# EAGLE design 05_NOT (EAGLE 7.5.0)
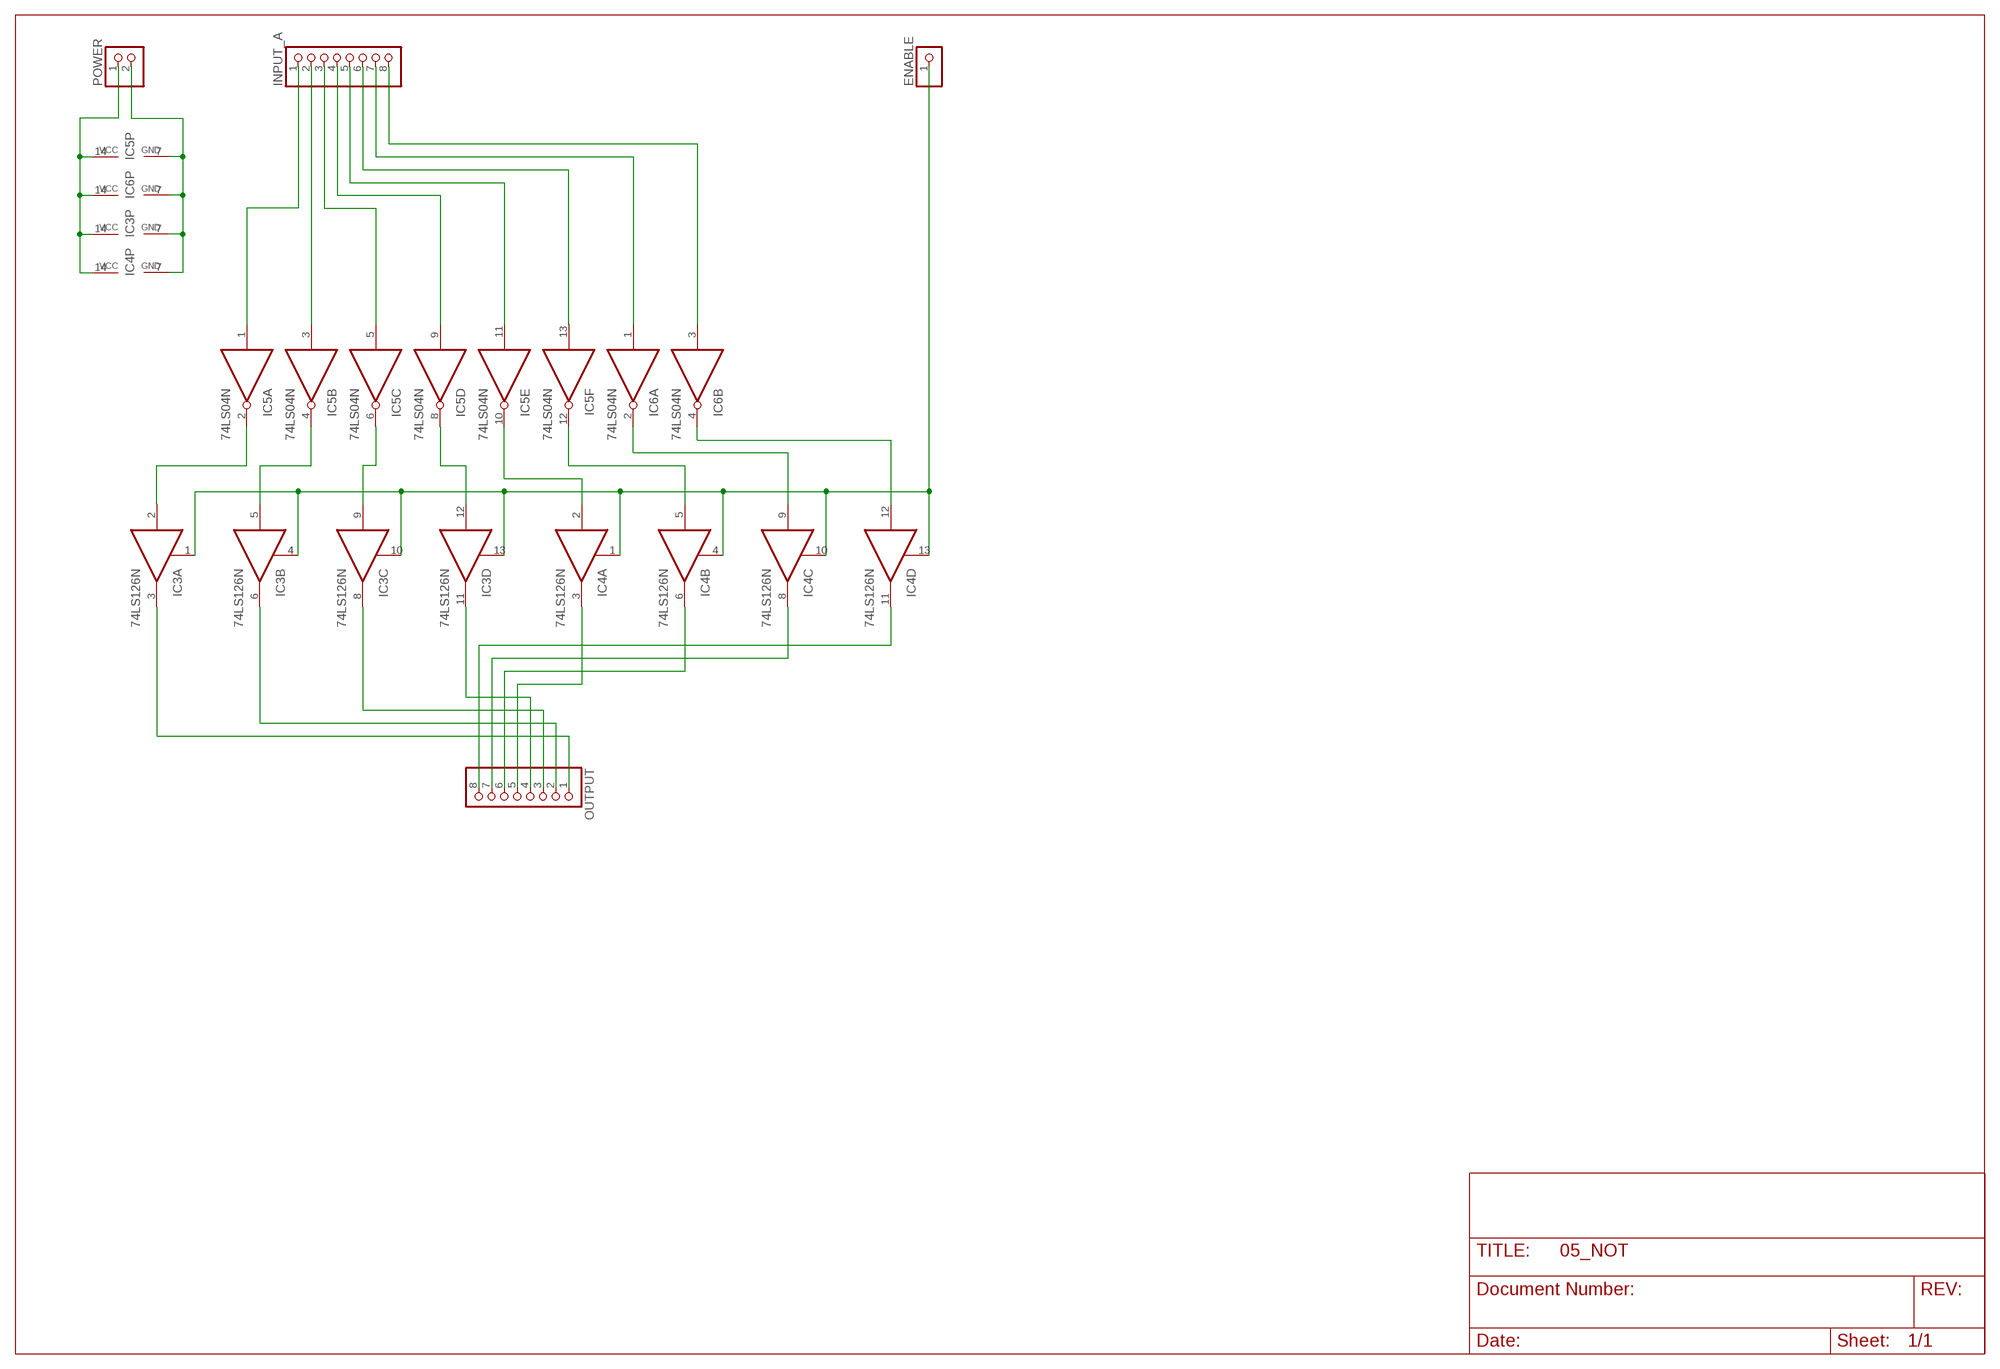
[diagram p0: schematic, sheet 1]

## Parts
ENABLE  PINHD-1X1  [1X01]
IC3  74LS126N  [DIL14]
IC4  74LS126N  [DIL14]
IC5  74LS04N  [DIL14]
IC6  74LS04N  [DIL14]
INPUT_A  PINHD-1X8  [1X08]
OUTPUT  PINHD-1X8  [1X08]
POWER  PINHD-1X2  [1X02]

## Nets
GND: IC3.7(P:GND) IC4.7(P:GND) IC5.7(P:GND) IC6.7(P:GND) POWER.2
N$1: IC5.1(A:I) INPUT_A.1
N$3: IC5.3(B:I) INPUT_A.2
N$5: IC5.5(C:I) INPUT_A.3
N$7: IC5.9(D:I) INPUT_A.4
N$9: IC5.11(E:I) INPUT_A.5
N$11: IC5.13(F:I) INPUT_A.6
N$13: IC6.1(A:I) INPUT_A.7
N$15: IC6.3(B:I) INPUT_A.8
N$18: IC3.5(B:I) IC5.4(B:O)
N$19: IC3.9(C:I) IC5.6(C:O)
N$20: IC3.12(D:I) IC5.8(D:O)
N$21: IC4.2(A:I) IC5.10(E:O)
N$22: IC4.5(B:I) IC5.12(F:O)
N$23: IC4.9(C:I) IC6.2(A:O)
N$24: IC4.12(D:I) IC6.4(B:O)
N$25: IC3.3(A:O) OUTPUT.1
N$26: IC3.6(B:O) OUTPUT.2
N$27: IC3.8(C:O) OUTPUT.3
N$28: IC3.11(D:O) OUTPUT.4
N$29: IC4.3(A:O) OUTPUT.5
N$30: IC4.6(B:O) OUTPUT.6
N$31: IC4.8(C:O) OUTPUT.7
N$32: IC4.11(D:O) OUTPUT.8
N$33: ENABLE.1 IC3.1(A:OE) IC3.4(B:OE) IC3.10(C:OE) IC3.13(D:OE) IC4.1(A:OE) IC4.4(B:OE) IC4.10(C:OE) IC4.13(D:OE)
N$34: IC3.2(A:I) IC5.2(A:O)
VCC: IC3.14(P:VCC) IC4.14(P:VCC) IC5.14(P:VCC) IC6.14(P:VCC) POWER.1
Unconnected: IC6.5(C:I) IC6.6(C:O) IC6.8(D:O) IC6.9(D:I) IC6.10(E:O) IC6.11(E:I) IC6.12(F:O) IC6.13(F:I)

## Library data of the parts
ENABLE = pinhead:PINHD-1X1: PIN HEADER
IC3 IC4 = 74xx-eu:74*126: Quad bus BUFFER, 3-state
IC5 IC6 = 74xx-eu:74*04: Hex INVERTER
INPUT_A OUTPUT = pinhead:PINHD-1X8: PIN HEADER
POWER = pinhead:PINHD-1X2: PIN HEADER

## Board
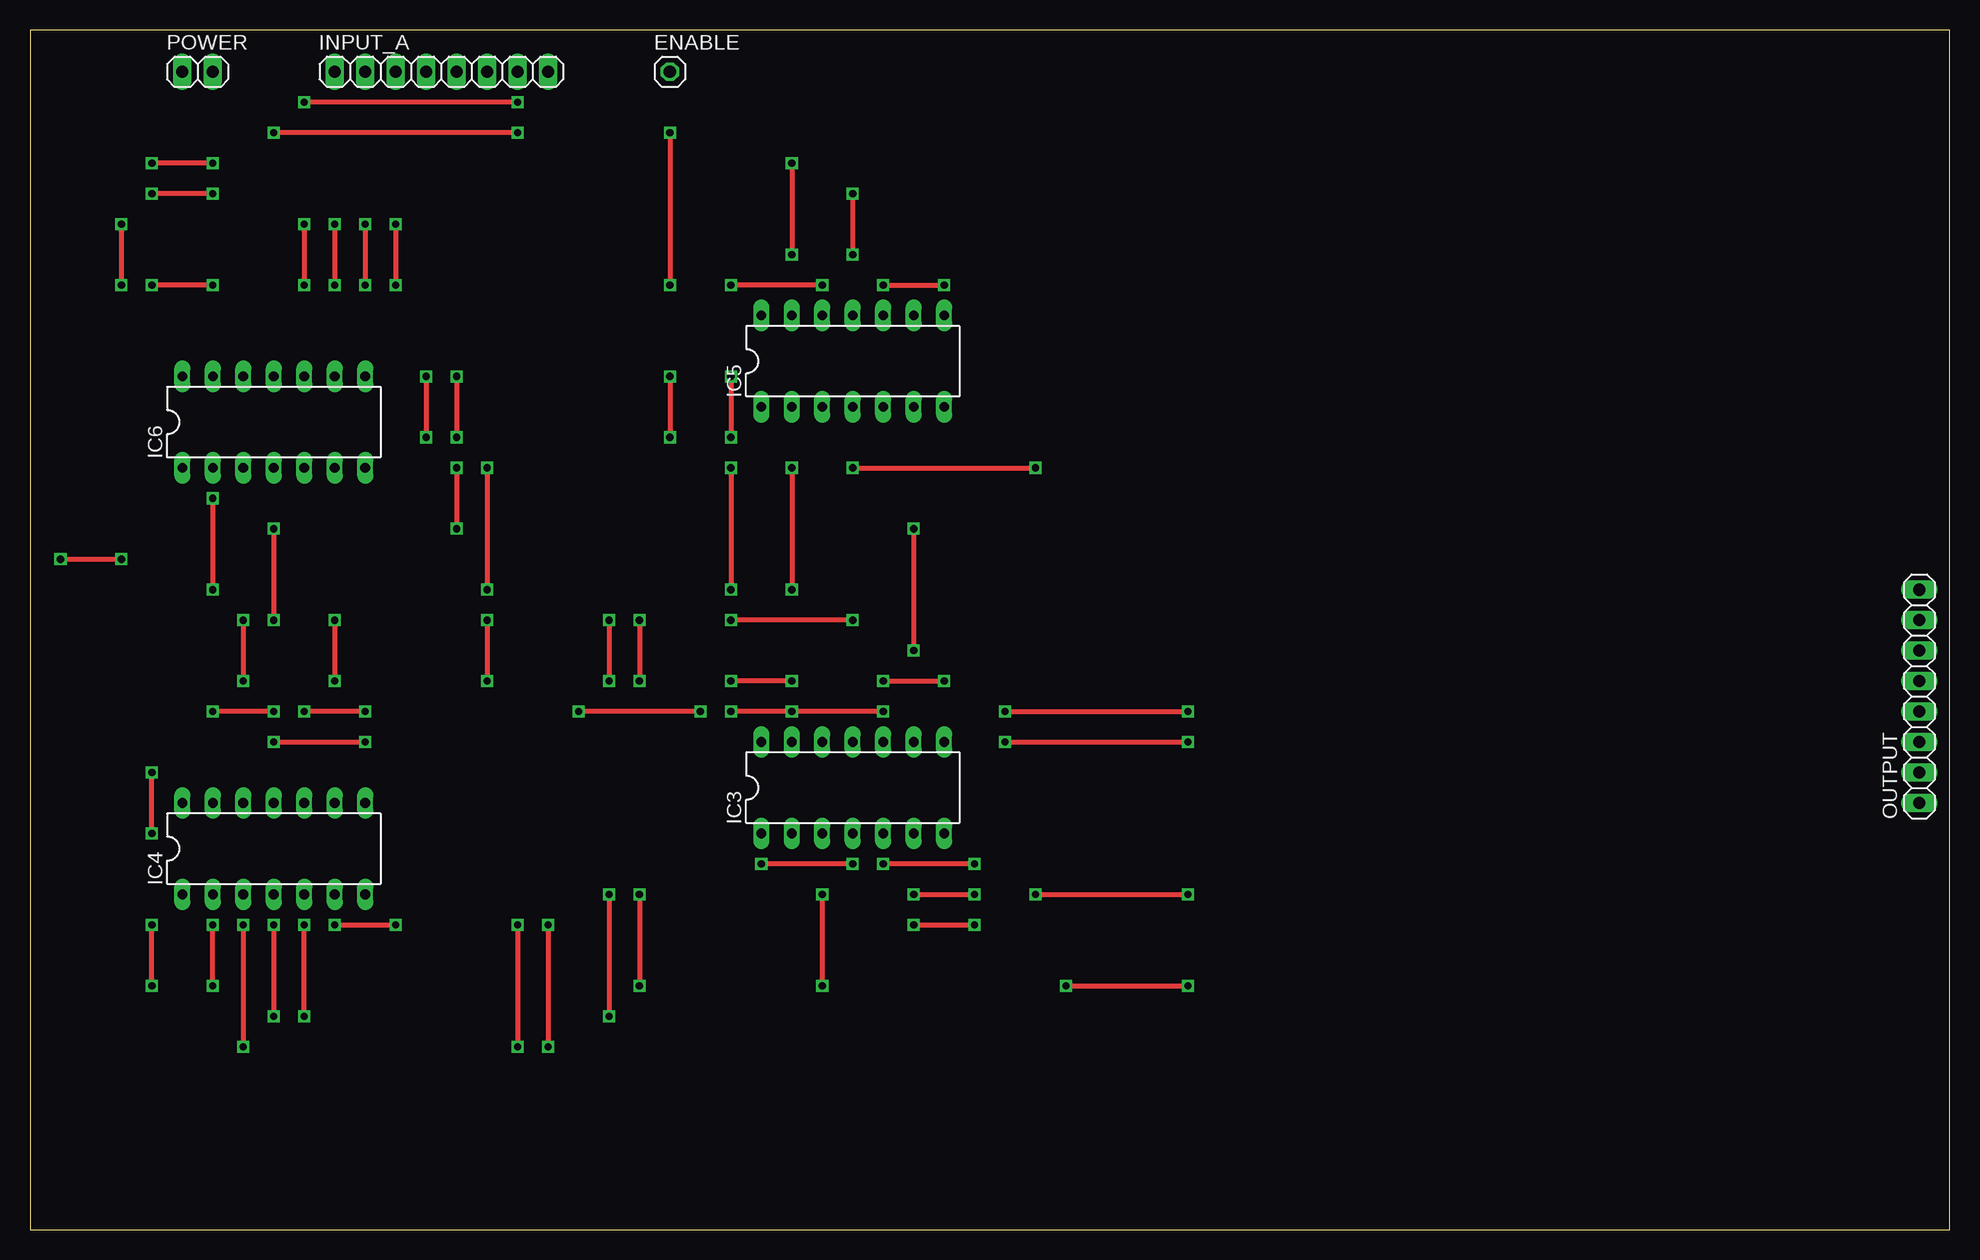
[diagram p1: board, top side]
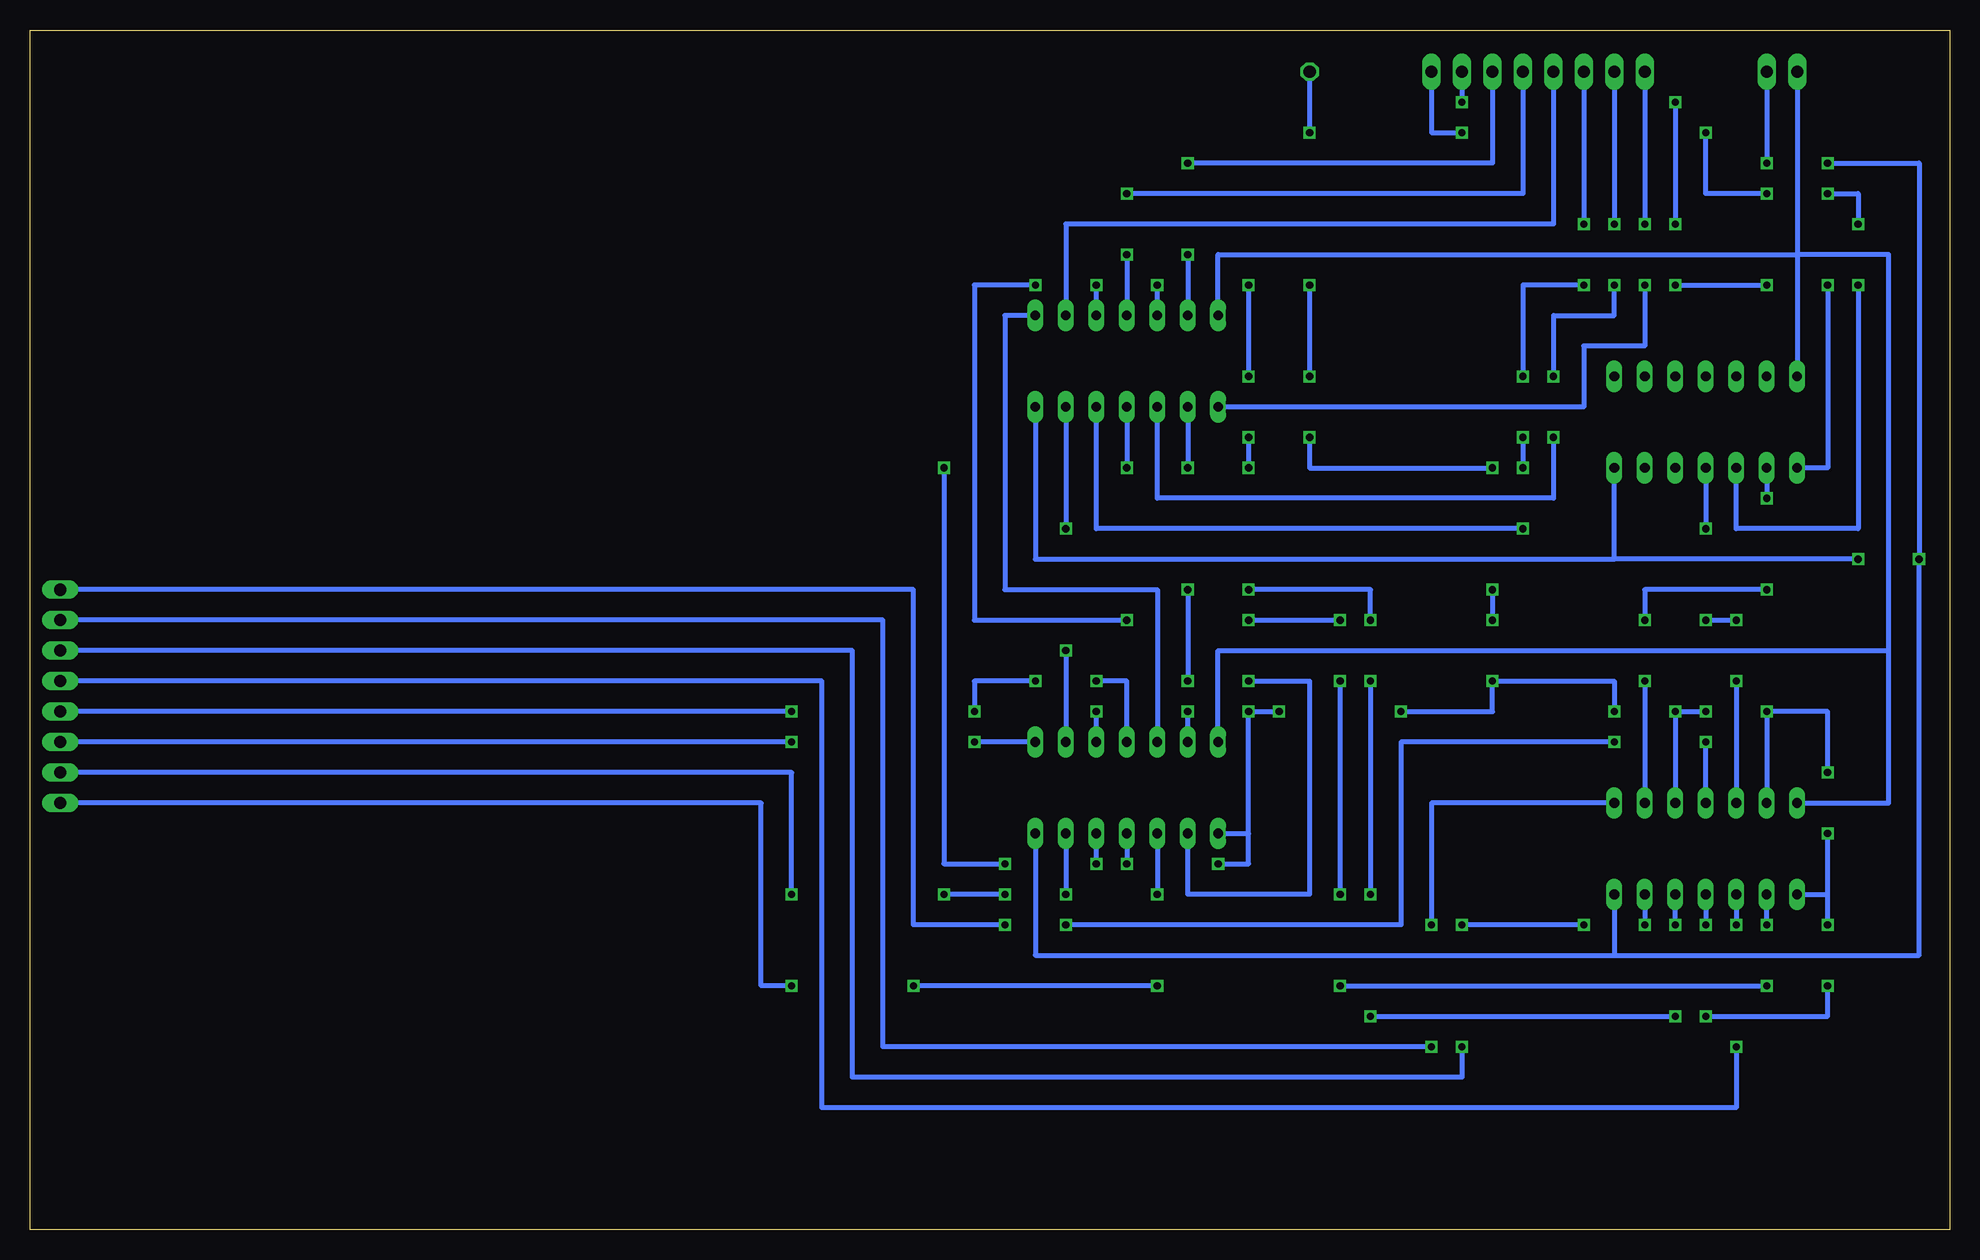
[diagram p2: board, bottom side, seen from below]

Size 160 x 100 mm. Coordinates in mm from the lower left corner, seen from the top.
Outline: 0,0 160,0 160,100 0,100 0,0
Copper layers (1*16): Top 0.035mm / dielectric 1.5mm / Bottom 0.035mm
Design rules "default": minimum track width 10mil, minimum drill 24mil, track to track 8mil, track to pad 8mil, pad to pad 8mil, via to via 8mil, smd to smd 8mil, copper to edge 40mil, drill to drill 8mil, minimum pad ring 10mil, minimum via ring 8mil, stop-mask expansion 4mil, vias tented up to drill 0mil, thermal gap 10mil

### Footprints (pad centres in the part's own frame; a part is rotated, then mirrored left to right if it is on the bottom)
1X01 = drill 1.016 octagon: 1 0,0
DIL14 = drill 0.813 long: 1 -7.62,-3.81; 2 -5.08,-3.81; 3 -2.54,-3.81; 4 0,-3.81; 5 2.54,-3.81; 6 5.08,-3.81; 7 7.62,-3.81; 8 7.62,3.81; 9 5.08,3.81; 10 2.54,3.81; 11 0,3.81; 12 -2.54,3.81; 13 -5.08,3.81; 14 -7.62,3.81
1X08 = drill 1.016 long: 1 -8.89,0; 2 -6.35,0; 3 -3.81,0; 4 -1.27,0; 5 1.27,0; 6 3.81,0; 7 6.35,0; 8 8.89,0
1X02 = drill 1.016 long: 1 -1.27,0; 2 1.27,0

### Placement (x,y rotation side)
ENABLE  53.34,96.52 0 top
IC3  68.58,36.83 0 top
IC4  20.32,31.75 0 top
IC5  68.58,72.39 0 top
IC6  20.32,67.31 0 top
INPUT_A  34.29,96.52 0 top
OUTPUT  157.48,44.45 90 top
POWER  13.97,96.52 0 top

### Tracks (layer width: path | path; a pad name or v marks a point on that pad's centre or on a via)
GND  (via drill 0.6)
  Top 0.406: v15.24,88.9 v10.16,88.9 | v2.54,55.88 v7.62,55.88
  Bottom 0.406: POWER.2 v15.24,88.9 | v10.16,88.9 2.54,88.9 v2.54,55.88 2.54,22.86 27.94,22.86 | v7.62,55.88 27.94,55.88 | 27.94,55.88 IC6.7 | IC5.7 76.2,55.88 27.94,55.88 | IC4.7 27.94,22.86 | IC3.7 76.2,22.86 27.94,22.86
N$1  (via drill 0.6)
  Top 0.406: v25.4,83.82 v25.4,78.74
  Bottom 0.406: INPUT_A.1 v25.4,83.82 | v25.4,78.74 25.4,73.66 30.48,73.66 30.48,68.58 IC5.1
N$3  (via drill 0.6)
  Top 0.406: v27.94,83.82 v27.94,78.74 | v33.02,71.12 v33.02,66.04
  Bottom 0.406: INPUT_A.2 v27.94,83.82 | v33.02,71.12 33.02,76.2 27.94,76.2 v27.94,78.74 | v33.02,66.04 33.02,60.96 66.04,60.96 IC5.3
N$5  (via drill 0.6)
  Top 0.406: v30.48,83.82 v30.48,78.74 | v35.56,71.12 v35.56,66.04 | v35.56,63.5 v35.56,58.42
  Bottom 0.406: INPUT_A.3 v30.48,83.82 | v30.48,78.74 35.56,78.74 v35.56,71.12 | v35.56,66.04 v35.56,63.5 | v35.56,58.42 71.12,58.42 IC5.5
N$7
  Bottom 0.406: INPUT_A.4 33.02,83.82 73.66,83.82 IC5.9
N$9  (via drill 0.6)
  Top 0.406: v68.58,86.36 v68.58,81.28
  Bottom 0.406: INPUT_A.5 35.56,86.36 v68.58,86.36 | v68.58,81.28 IC5.11
N$11  (via drill 0.6)
  Top 0.406: v63.5,88.9 v63.5,81.28
  Bottom 0.406: INPUT_A.6 38.1,88.9 v63.5,88.9 | v63.5,81.28 IC5.13
N$13  (via drill 0.6)
  Top 0.406: v40.64,93.98 v22.86,93.98 | v22.86,83.82 v22.86,78.74 | v15.24,78.74 v10.16,78.74
  Bottom 0.406: INPUT_A.7 v40.64,93.98 | v22.86,93.98 v22.86,83.82 | v22.86,78.74 v15.24,78.74 | v10.16,78.74 10.16,63.5 IC6.1
N$15  (via drill 0.6)
  Top 0.406: v40.64,91.44 v20.32,91.44 | v15.24,86.36 v10.16,86.36 | v7.62,83.82 v7.62,78.74
  Bottom 0.406: INPUT_A.8 43.18,91.44 v40.64,91.44 | v10.16,86.36 7.62,86.36 v7.62,83.82 | v7.62,78.74 7.62,58.42 17.78,58.42 IC6.3 | v15.24,86.36 20.32,86.36 v20.32,91.44
N$18  (via drill 0.6)
  Top 0.406: v68.58,63.5 v83.82,63.5 | v78.74,30.48 v71.12,30.48
  Bottom 0.406: IC5.4 v68.58,63.5 | v83.82,63.5 83.82,30.48 v78.74,30.48 | v71.12,30.48 IC3.5
N$19  (via drill 0.6)
  Top 0.406: v73.66,58.42 v73.66,48.26
  Bottom 0.406: IC5.6 v73.66,58.42 | v73.66,48.26 IC3.9
N$20
  Bottom 0.406: IC5.8 78.74,76.2 78.74,53.34 66.04,53.34 IC3.12
N$21  (via drill 0.6)
  Top 0.406: v71.12,78.74 v76.2,78.74 | v68.58,50.8 v58.42,50.8 | v50.8,27.94 v50.8,20.32 | v15.24,20.32 v15.24,25.4 | v50.8,50.8 v50.8,45.72
  Bottom 0.406: IC5.10 v71.12,78.74 | v76.2,78.74 81.28,78.74 81.28,50.8 v68.58,50.8 | v58.42,50.8 v50.8,50.8 | v50.8,20.32 v15.24,20.32 | v15.24,25.4 IC4.2 | v50.8,45.72 v50.8,27.94
N$22  (via drill 0.6)
  Top 0.406: v66.04,78.74 v58.42,78.74 | v58.42,71.12 v58.42,66.04 | v58.42,63.5 v58.42,53.34 | v48.26,50.8 v48.26,45.72 | v22.86,17.78 v22.86,25.4 | v48.26,27.94 v48.26,17.78
  Bottom 0.406: IC5.12 v66.04,78.74 | v58.42,78.74 v58.42,71.12 | v58.42,66.04 v58.42,63.5 | v48.26,45.72 v48.26,27.94 | v48.26,50.8 48.26,53.34 v58.42,53.34 | v48.26,17.78 v22.86,17.78 | v22.86,25.4 IC4.5
N$23  (via drill 0.6)
  Top 0.406: v15.24,60.96 v15.24,53.34 | v25.4,50.8 v25.4,45.72
  Bottom 0.406: IC6.2 v15.24,60.96 | v15.24,53.34 25.4,53.34 v25.4,50.8 | v25.4,45.72 IC4.9
N$24  (via drill 0.6)
  Top 0.406: v20.32,58.42 v20.32,50.8 | v17.78,50.8 v17.78,45.72
  Bottom 0.406: IC6.4 v20.32,58.42 | v20.32,50.8 v17.78,50.8 | v17.78,45.72 IC4.12
N$25  (via drill 0.6)
  Top 0.406: v66.04,27.94 v66.04,20.32 | v86.36,20.32 v96.52,20.32
  Bottom 0.406: IC3.3 v66.04,27.94 | v66.04,20.32 v86.36,20.32 | v96.52,20.32 99.06,20.32 99.06,35.56 OUTPUT.1
N$26  (via drill 0.6)
  Top 0.406: v73.66,27.94 v78.74,27.94 | v83.82,27.94 v96.52,27.94
  Bottom 0.406: IC3.6 v73.66,27.94 | v78.74,27.94 v83.82,27.94 | v96.52,27.94 96.52,38.1 OUTPUT.2
N$27  (via drill 0.6)
  Top 0.406: v81.28,40.64 v96.52,40.64
  Bottom 0.406: IC3.8 v81.28,40.64 | v96.52,40.64 OUTPUT.3
N$28  (via drill 0.6)
  Top 0.406: v71.12,45.72 v76.2,45.72 | v81.28,43.18 v96.52,43.18
  Bottom 0.406: IC3.11 68.58,45.72 v71.12,45.72 | v76.2,45.72 81.28,45.72 v81.28,43.18 | v96.52,43.18 OUTPUT.4
N$29  (via drill 0.6)
  Top 0.406: v17.78,25.4 v17.78,15.24
  Bottom 0.406: IC4.3 v17.78,25.4 | v17.78,15.24 17.78,10.16 93.98,10.16 93.98,45.72 OUTPUT.5
N$30  (via drill 0.6)
  Top 0.406: v25.4,25.4 v30.48,25.4 | v40.64,25.4 v40.64,15.24
  Bottom 0.406: IC4.6 v25.4,25.4 | v30.48,25.4 v40.64,25.4 | v40.64,15.24 40.64,12.7 91.44,12.7 91.44,48.26 OUTPUT.6
N$31  (via drill 0.6)
  Top 0.406: v43.18,25.4 v43.18,15.24
  Bottom 0.406: IC4.8 43.18,35.56 v43.18,25.4 | v43.18,15.24 88.9,15.24 88.9,50.8 OUTPUT.7
N$32  (via drill 0.6)
  Top 0.406: v20.32,40.64 v27.94,40.64 | v73.66,25.4 v78.74,25.4
  Bottom 0.406: IC4.11 v20.32,40.64 | v27.94,40.64 45.72,40.64 45.72,25.4 v73.66,25.4 | v78.74,25.4 86.36,25.4 86.36,53.34 OUTPUT.8
N$33  (via drill 0.6)
  Top 0.406: v53.34,91.44 v53.34,78.74 | v53.34,71.12 v53.34,66.04 | v38.1,63.5 v38.1,53.34 | v38.1,50.8 v38.1,45.72 | v27.94,43.18 v22.86,43.18 | v20.32,43.18 v15.24,43.18 | v58.42,43.18 v63.5,43.18 v71.12,43.18 | v55.88,43.18 v45.72,43.18 | v68.58,30.48 v60.96,30.48 | v10.16,33.02 v10.16,38.1 | v20.32,25.4 v20.32,17.78 | v10.16,20.32 v10.16,25.4
  Bottom 0.406: ENABLE.1 v53.34,91.44 | v53.34,78.74 v53.34,71.12 | v53.34,66.04 53.34,63.5 v38.1,63.5 | v38.1,53.34 v38.1,50.8 | v27.94,43.18 27.94,45.72 v38.1,45.72 38.1,43.18 v45.72,43.18 | v20.32,43.18 v22.86,43.18 IC4.10 | IC4.13 v15.24,43.18 10.16,43.18 v10.16,38.1 | IC3.13 v63.5,43.18 | v55.88,43.18 v58.42,43.18 58.42,33.02 | IC3.10 v71.12,43.18 | IC3.1 58.42,33.02 | IC3.4 v68.58,30.48 | v60.96,30.48 58.42,30.48 58.42,33.02 | IC4.1 10.16,27.94 | 10.16,27.94 v10.16,33.02 | IC4.4 v20.32,25.4 | v20.32,17.78 10.16,17.78 v10.16,20.32 | v10.16,25.4 10.16,27.94
  other vias: 12.7,27.94
N$34  (via drill 0.6)
  Top 0.406: v63.5,63.5 v63.5,53.34 | v63.5,45.72 v58.42,45.72
  Bottom 0.406: IC5.2 v63.5,63.5 | v63.5,53.34 v63.5,45.72 | v58.42,45.72 53.34,45.72 53.34,27.94 63.5,27.94 IC3.2
VCC
  Bottom 0.406: POWER.1 12.7,81.28 | 12.7,81.28 IC6.14 | IC5.14 60.96,81.28 12.7,81.28 | IC4.14 5.08,35.56 5.08,48.26 | 5.08,48.26 5.08,81.28 12.7,81.28 | IC3.14 60.96,48.26 5.08,48.26